# EAGLE design greippi_neg_boost (EAGLE 7.4.0)
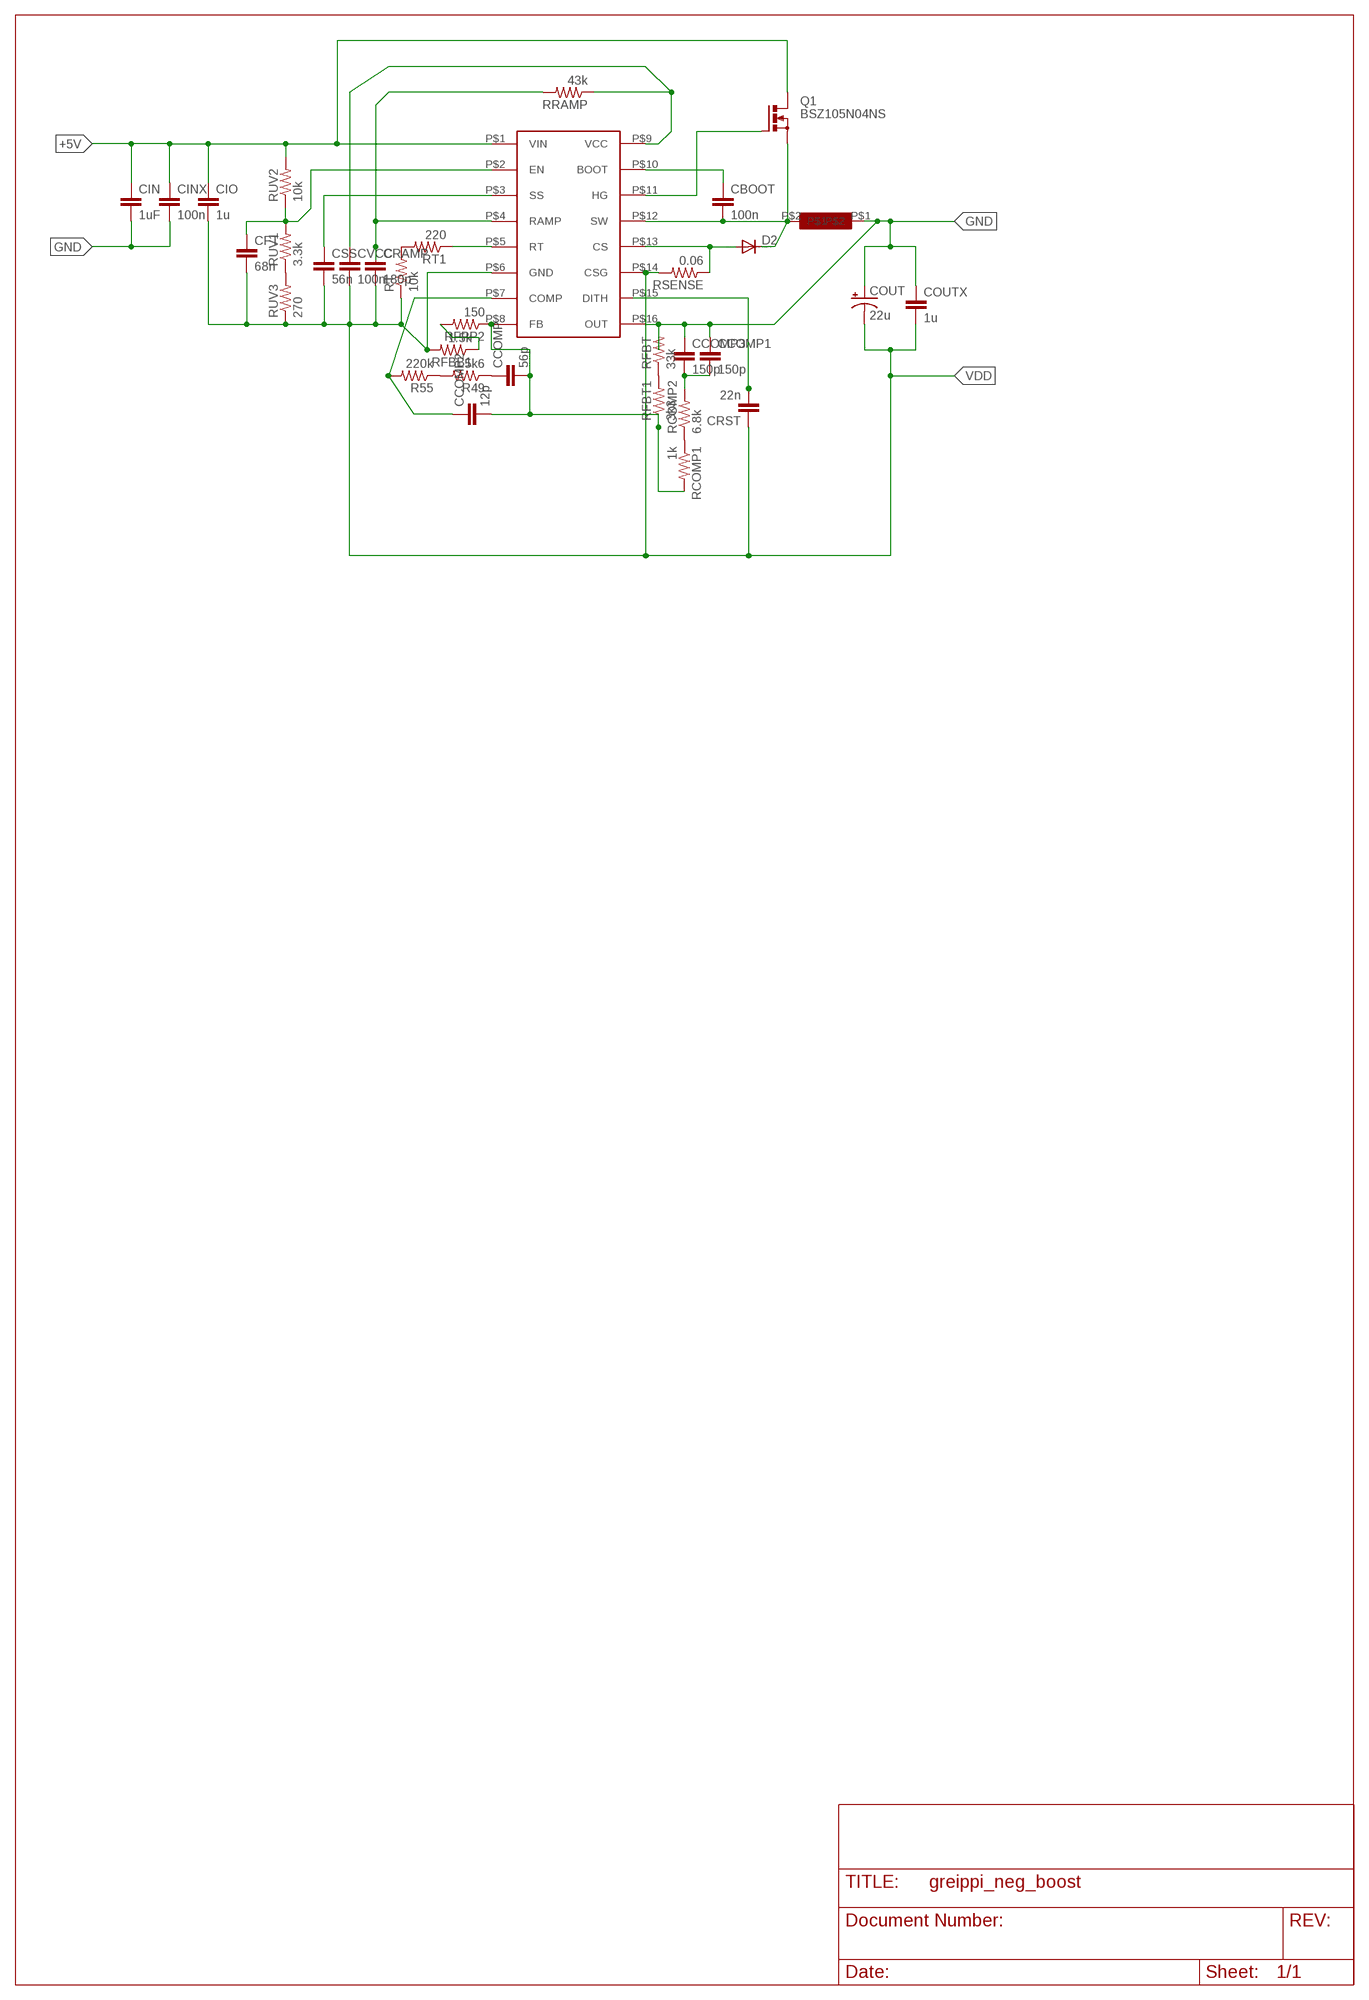
[diagram p0: schematic, sheet 1]

## Parts
CBOOT  100n  C-EUC0805  [C0805]
CCOMP  56p  C-EUC0805  [C0805]
CCOMP1  150p  C-EUC0805  [C0805]
CCOMP2  12p  C-EUC0805  [C0805]
CCOMP3  150p  C-EUC0805  [C0805]
CFT  68n  C-EUC0805  [C0805]
CIN  1uF  C-EUC0805  [C0805]
CINX  100n  C-EUC0805  [C0805]
CIO  1u  C-EUC0805  [C0805]
COUT  22u  CPOL-USE5-5  [E5-5]
COUTX  1u  C-EUC0805  [C0805]
CRAMP  180p  C-EUC0805  [C0805]
CRST  22n  C-EUC0805  [C0805]
CSS  56n  C-EUC0805  [C0805]
CVCC  100n  C-EUC0805  [C0805]
D2  DIODE-SOD123  [SOD123]
Q1  BSZ105N04NS  [PG-TDSON-8]
R49  5k6  R-US_R0805  [R0805]
R55  220k  R-US_R0805  [R0805]
RCOMP1  1k  R-US_R0805  [R0805]
RCOMP2  6.8k  R-US_R0805  [R0805]
RFBB1  1.5k  R-US_R0805  [R0805]
RFBT  33k  R-US_R0805  [R0805]
RFBT1  3k3  R-US_R0805  [R0805]
RFPP2  150  R-US_R0805  [R0805]
RRAMP  43k  R-US_R0805  [R0805]
RSENSE  0.06  R-US_R0805  [R0805]
RT  10k  R-US_R0805  [R0805]
RT1  220  R-US_R0805  [R0805]
RUV1  3.3k  R-US_R0805  [R0805]
RUV2  10k  R-US_R0805  [R0805]
RUV3  270  R-US_R0805  [R0805]
U$2  LM5088  [LM5088]
U$3  KLICK_INDUCTOR01  [KLICK_INDUCTOR01]

## Nets
+5V: CIN.1 CINX.1 CIO.1 Q1.5(D) Q1.6(D) Q1.7(D) Q1.8(D) Q1.TH(D) RUV2.2 U$2.P$1(VIN)
GND: CCOMP1.1 CCOMP3.1 CIN.2 CINX.2 COUT.+ COUTX.1 RFBT.2 U$2.P$16(OUT) U$3.P$1
N$43: CFT.1 RUV1.2 RUV2.1 U$2.P$2(EN)
N$45: CSS.1 U$2.P$3(SS)
N$48: CVCC.1 RRAMP.1 U$2.P$9(VCC)
N$52: D2.A RSENSE.1 U$2.P$13(CS)
N$53: CRAMP.1 RRAMP.2 U$2.P$4(RAMP)
N$54: RT1.2 RT.2
N$55: RUV1.1 RUV3.2
N$56: CCOMP.1 R49.1
N$57: CCOMP2.2 CCOMP.2 RCOMP1.2 RFBT1.1 RFPP2.1 U$2.P$8(FB)
N$58: CCOMP2.1 R55.2 U$2.P$7(COMP)
N$59: CBOOT.1 U$2.P$10(BOOT)
N$60: CRST.2 U$2.P$15(DITH)
N$61: CBOOT.2 D2.C Q1.1(S) Q1.2(S) Q1.3(S) U$2.P$12(SW) U$3.P$2
N$62: RFBB1.1 RFPP2.2
N$65: Q1.4(G) U$2.P$11(HG)
N$66: R49.2 R55.1
N$71: CCOMP1.2 CCOMP3.2 RCOMP2.2
N$72: RT1.1 U$2.P$5(RT)
N$73: RCOMP1.1 RCOMP2.1
N$74: RFBT1.2 RFBT.1
VDD: CFT.2 CIO.2 COUT.- COUTX.2 CRAMP.2 CRST.1 CSS.2 CVCC.2 RFBB1.2 RSENSE.2 RT.1 RUV3.1 U$2.P$6(GND) U$2.P$14(CSG)

## Library data of the parts
CBOOT CCOMP CCOMP1-CCOMP3 CFT CIN CINX CIO COUTX CRAMP CRST CSS CVCC = rcl:C-EU: CAPACITOR, European symbol
COUT = rcl:CPOL-US: POLARIZED CAPACITOR, American symbol
D2 = diode:DIODE-: DIODE
Q1 = transistor-power:BSZ105N04NS: OptiMOS (TM)3 Power-Transistor N-Channel, Normal level Source : Data sheet <http://www.infineon.com/dgdl/BSZ105N04NSG_rev1.1.pdf?folderId=db3a3043156fd5730115c7d50620107c&fileId=db3a30431689f4420116c485c67f084e>
R49 R55 RCOMP1 RCOMP2 RFBB1 RFBT RFBT1 RFPP2 RRAMP RSENSE RT RT1 RUV1-RUV3 = rcl:R-US_: RESISTOR, American symbol
U$2 = Klick_custom_lm5088:LM5088
U$3 = Klick_inductor01:KLICK_INDUCTOR01

## Board
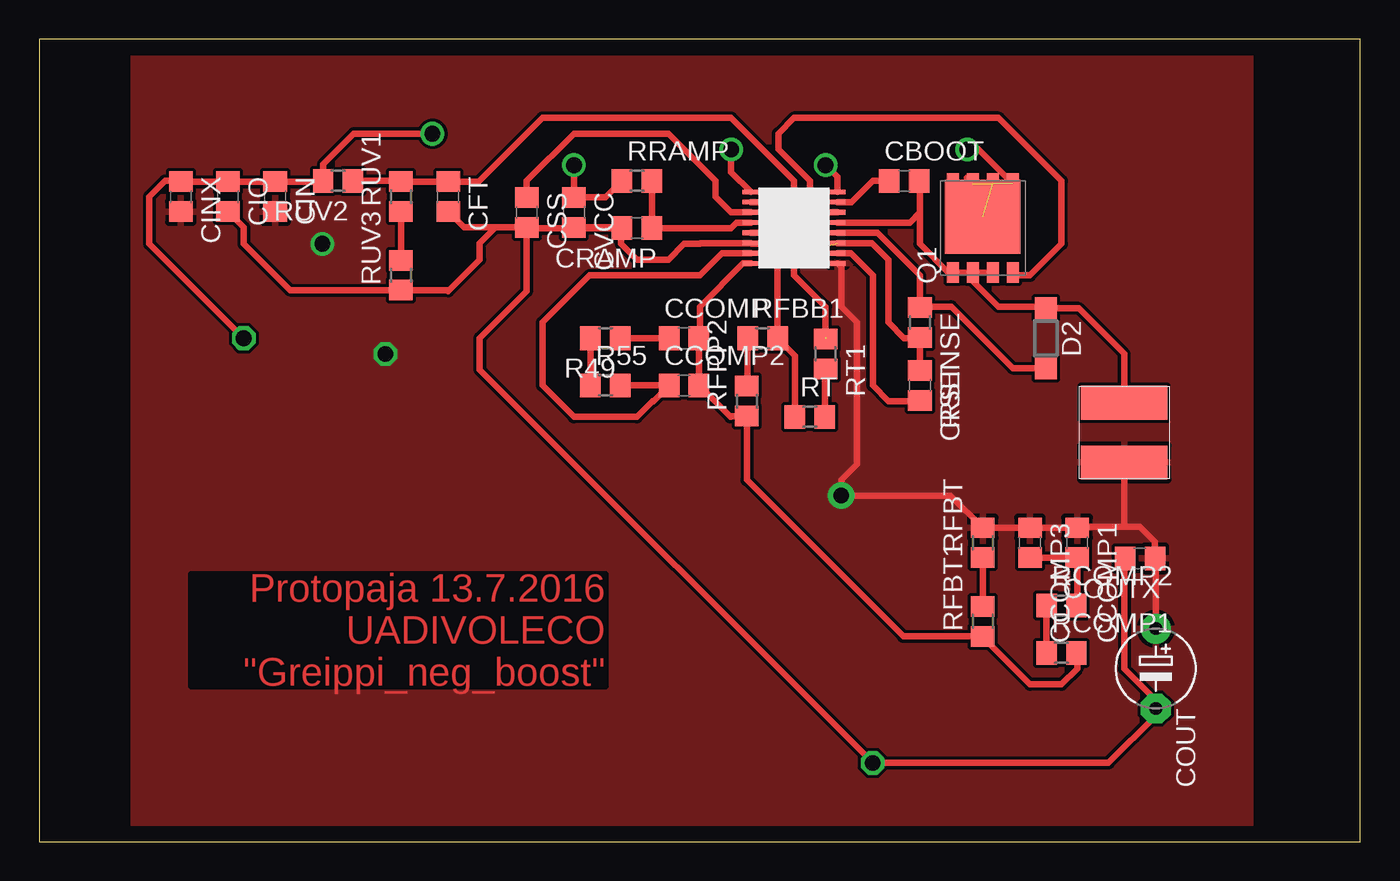
[diagram p1: board, top side]
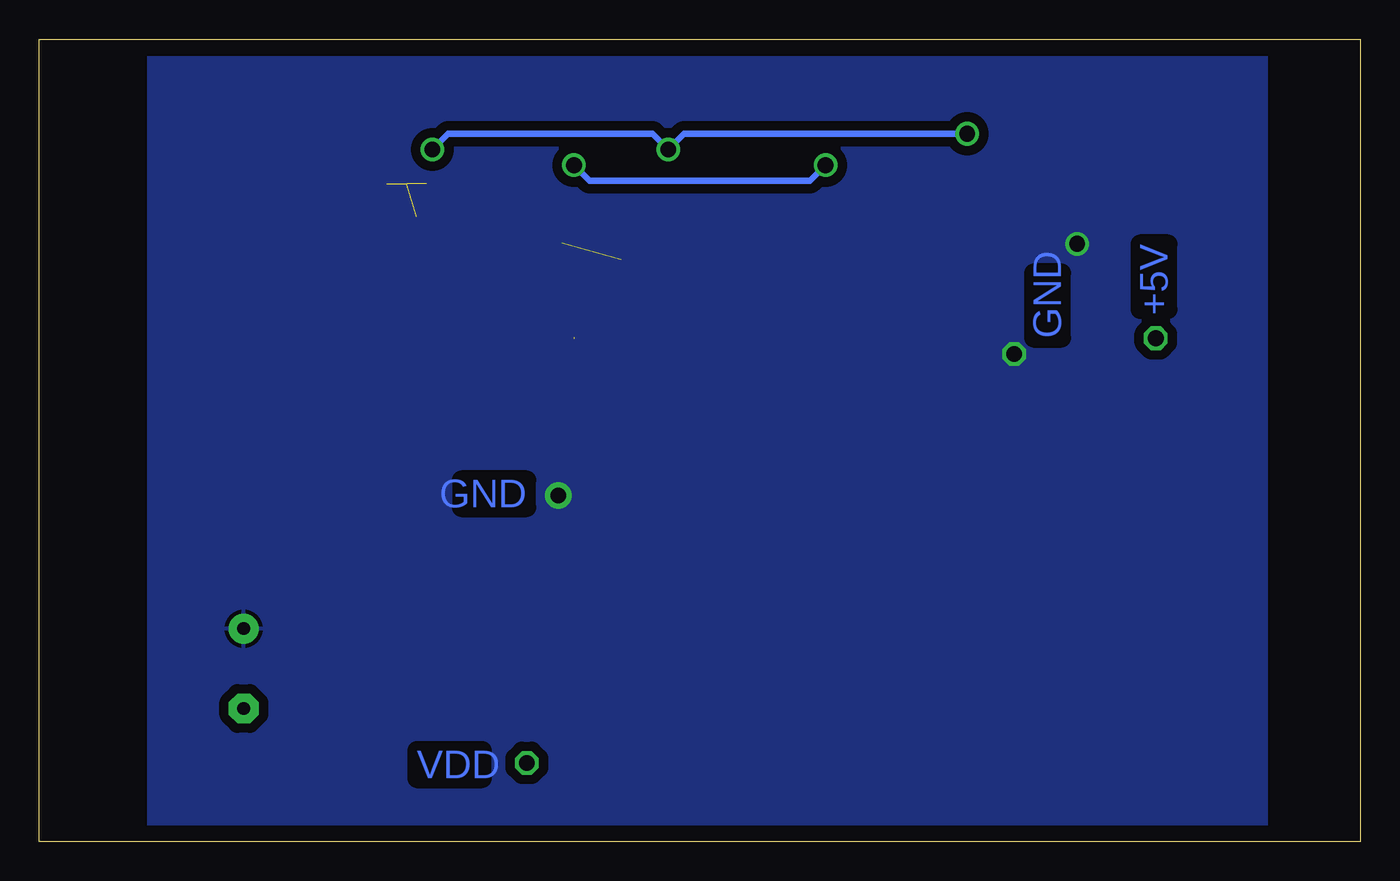
[diagram p2: board, bottom side, seen from below]

Size 84 x 51 mm. Coordinates in mm from the lower left corner, seen from the top.
Outline: 0,0 84,0 84,51 0,51 0,0
Copper layers (1*16): Top 0.035mm / dielectric 1.5mm / Bottom 0.035mm
Design rules "default": minimum track width 10mil, minimum drill 24mil, track to track 8mil, track to pad 8mil, pad to pad 8mil, via to via 8mil, smd to smd 8mil, copper to edge 40mil, drill to drill 8mil, minimum pad ring 10mil, minimum via ring 8mil, stop-mask expansion 4mil, vias tented up to drill 0mil, thermal gap 10mil

### Footprints (pad centres in the part's own frame; a part is rotated, then mirrored left to right if it is on the bottom)
C0805 = smd 1.3 x 1.5: 1 -0.95,0; 2 0.95,0
E5-5 = drill 0.813 pad 1.905: + -2.54,0 | drill 0.813 pad 1.905 octagon: - 2.54,0
SOD123 = smd 1.4 x 1.4: A 1.9,0; C -1.9,0
PG-TDSON-8 = smd 1.3 x 0.75: 1 -2.825,1.905; 2 -2.825,0.635; 3 -2.825,-0.635; 4 -2.825,-1.905; 5 2.825,-1.905; 6 2.825,-0.635; 7 2.825,0.635; 8 2.825,1.905 | smd 4.7 x 4.8: TH 0.725,0
R0805 = smd 1.3 x 1.5: 1 -0.95,0; 2 0.95,0
LM5088 = smd 1.05 x 0.3: P$1 -2.75,2.3; P$2 -2.75,1.65; P$3 -2.75,1; P$4 -2.75,0.35; P$5 -2.75,-0.3; P$6 -2.75,-0.95; P$7 -2.75,-1.6; P$8 -2.75,-2.25; P$9 2.75,2.3; P$10 2.75,1.65; P$11 2.75,1; P$12 2.75,0.35; P$13 2.75,-0.3; P$14 2.75,-0.95; P$15 2.75,-1.6; P$16 2.75,-2.25
KLICK_INDUCTOR01 = smd 2.15 x 5.5: P$1 -1.9,0; P$2 1.9,0

### Placement (x,y rotation side)
CBOOT  55,42 0 top
CCOMP  41,32 0 top
CCOMP1  66,19 270 top
CCOMP2  41,29 0 top
CCOMP3  63,19 270 top
CFT  26,41 270 top
CIN  15,41 270 top
CINX  9,41 270 top
CIO  12,41 270 top
COUT  71,11 270 top
COUTX  70,18 180 top
CRAMP  38,39 180 top
CRST  56,29 270 top
CSS  31,40 270 top
CVCC  34,40 270 top
D2  64,32 270 top
Q1  60,39 90 top
R49  36,32 180 top
R55  36,29 0 top
RCOMP1  65,12 0 top
RCOMP2  65,15 0 top
RFBB1  46,32 0 top
RFBT  60,19 90 top
RFBT1  60,14 90 top
RFPP2  45,28 90 top
RRAMP  38,42 0 top
RSENSE  56,33 270 top
RT  49,27 0 top
RT1  50,31 270 top
RUV1  23,41 90 top
RUV2  19,42 180 top
RUV3  23,36 90 top
U$2  48,39 0 top
U$3  69,26 90 top

### Tracks (layer width: path | path; a pad name or v marks a point on that pad's centre or on a via)
+5V  (via drill 1 pad 1.42)  (3 unrouted)
  Top 0.406: CINX.1 CIO.1 CIN.1 | CINX.1 18.05,41.95 RUV2.2 18.05,43.05 20,45 v25,45 | CINX.1 8.95,42 8,42 7,41 7,38 v13,32 | Q1.8 Q1.7 59,42.19 | U$2.P$1 44,42.55 v44,44 | Q1.5 59.73,44 v59,44
  Bottom 0.406: v25,45 43,45 v44,44 45,45 58,45 v59,44
GND  (via drill 1 pad 1.42, 1 pad 1.68)
  Top 0.406: U$2.P$16 51,36.5 51,34 52,33 52,24 51,23 v51,22 57.95,22 RFBT.2 CCOMP3.1 CCOMP1.1 66.05,20 69,20 | 69,20 70,20 70.95,19.05 COUTX.1 71,17.95 COUT.+ | U$3.P$1 69,20
  other vias: 18,38 22,31
  pour Bottom (isolate 0.61): 6,50 6,1 77,1 77,50
  pour Top: 6,50 6,1 77,1 77,50
N$43
  Top 0.406: RUV2.1 22.95,42 RUV1.2 CFT.1 27.95,41.95 32,46 44,46 48,42 48,41 47.65,40.65 U$2.P$2
N$45
  Top 0.406: CSS.1 31,42 34,45 40,45 43,42 43,41 44,40 U$2.P$3
N$48  (via drill 1 pad 1.42)
  Top 0.406: RRAMP.1 36,40.95 CVCC.1 v34,43 | v50,43 50.75,42.25 U$2.P$9
  Bottom 0.406: v34,43 35,42 49,42 v50,43
N$52
  Top 0.406: D2.A 61.9,30.1 58,34 56.05,34 RSENSE.1 56,36 53.3,38.7 U$2.P$13
N$53
  Top 0.406: RRAMP.2 CRAMP.1 44,39 44.35,39.35 U$2.P$4
N$54
  Top 0.406: RT1.2 49.95,30 RT.2
N$55
  Top 0.406: RUV1.1 RUV3.2
N$56
  Top 0.406: R49.1 CCOMP.1
N$57
  Top 0.406: RCOMP1.2 66,11.95 66,11 65,10 63,10 60,13 RFBT1.1 54.95,13.05 45,23 RFPP2.1 44.05,27.05 44,27 43.95,27 CCOMP2.2 CCOMP.2 42,32.05 42,34 44.75,36.75 U$2.P$8
N$58
  Top 0.406: R55.2 CCOMP2.1 39.05,28 39,28 38,27 34,27 32,29 32,33 35,36 42,36 43.4,37.4 U$2.P$7
N$59
  Top 0.406: U$2.P$10 51.65,40.65 53,42 CBOOT.1
N$60
  Top 0.406: CRST.2 55.95,28 54,28 53,29 53,36 51.6,37.4 U$2.P$15
N$61
  Top 0.406: Q1.2 Q1.1 57.83,36.17 56,38 56,40 | Q1.2 Q1.3 | Q1.2 59.37,35.64 61,34 63.9,34 D2.C 66.1,33.9 69,31 U$3.P$2 | CBOOT.2 56,41.95 56,40 | 56,40 55.35,39.35 U$2.P$12
N$62
  Top 0.406: RFPP2.2 45.05,29 RFBB1.1
N$65
  Top 0.406: U$2.P$11 49,40 49,42 47,44 47,45 48,46 61,46 65,42 65,38 63,36 62.08,36 Q1.4
N$66
  Top 0.406: R49.2 R55.1
N$71
  Top 0.406: CCOMP3.2 CCOMP1.2 66,15.05 RCOMP2.2
N$72  (1 unrouted)
  Top 0.406: U$2.P$5 47.3,38.7 48,38 48,36 50,34 50,32.05
N$73
  Top 0.406: RCOMP2.1 RCOMP1.1
N$74
  Top 0.406: RFBT.1 RFBT1.2
VDD  (via drill 1 pad 1.42)  (1 unrouted)
  Top 0.406: CIO.2 13,39.05 13,38 15.95,35.05 RUV3.1 25.95,35.05 26,35 28,37 28,38.05 29,39.05 | CFT.2 27,39.05 29,39.05 | 29,39.05 CSS.2 31.05,39 34,39 CVCC.2 37,39.05 CRAMP.2 | RT.1 48.05,30.9 RFBB1.2 46.95,36.95 47,37 46,38 45.3,38 U$2.P$6 42.05,38.05 42,38 41,38 40,37 38,37 37,38 37,38.95 CRAMP.2 | COUTX.2 69,17.95 69,11 71,9 COUT.- 71,8 68,5 v53,5 28,30 28,32 31,35 31,39 CRAMP.2 | CRST.1 RSENSE.2 55.95,32 55,32 54,33 54,37 52.95,38.05 U$2.P$14
  Bottom 0.406: 71,8 COUT.-

### Text on the board
Top: Protopaja 13.7.2016 / UADIVOLECO / "Greippi_neg_boost"
Bottom: +5V | GND | GND | VDD